# EAGLE design Z80HW (EAGLE 7.7.0)
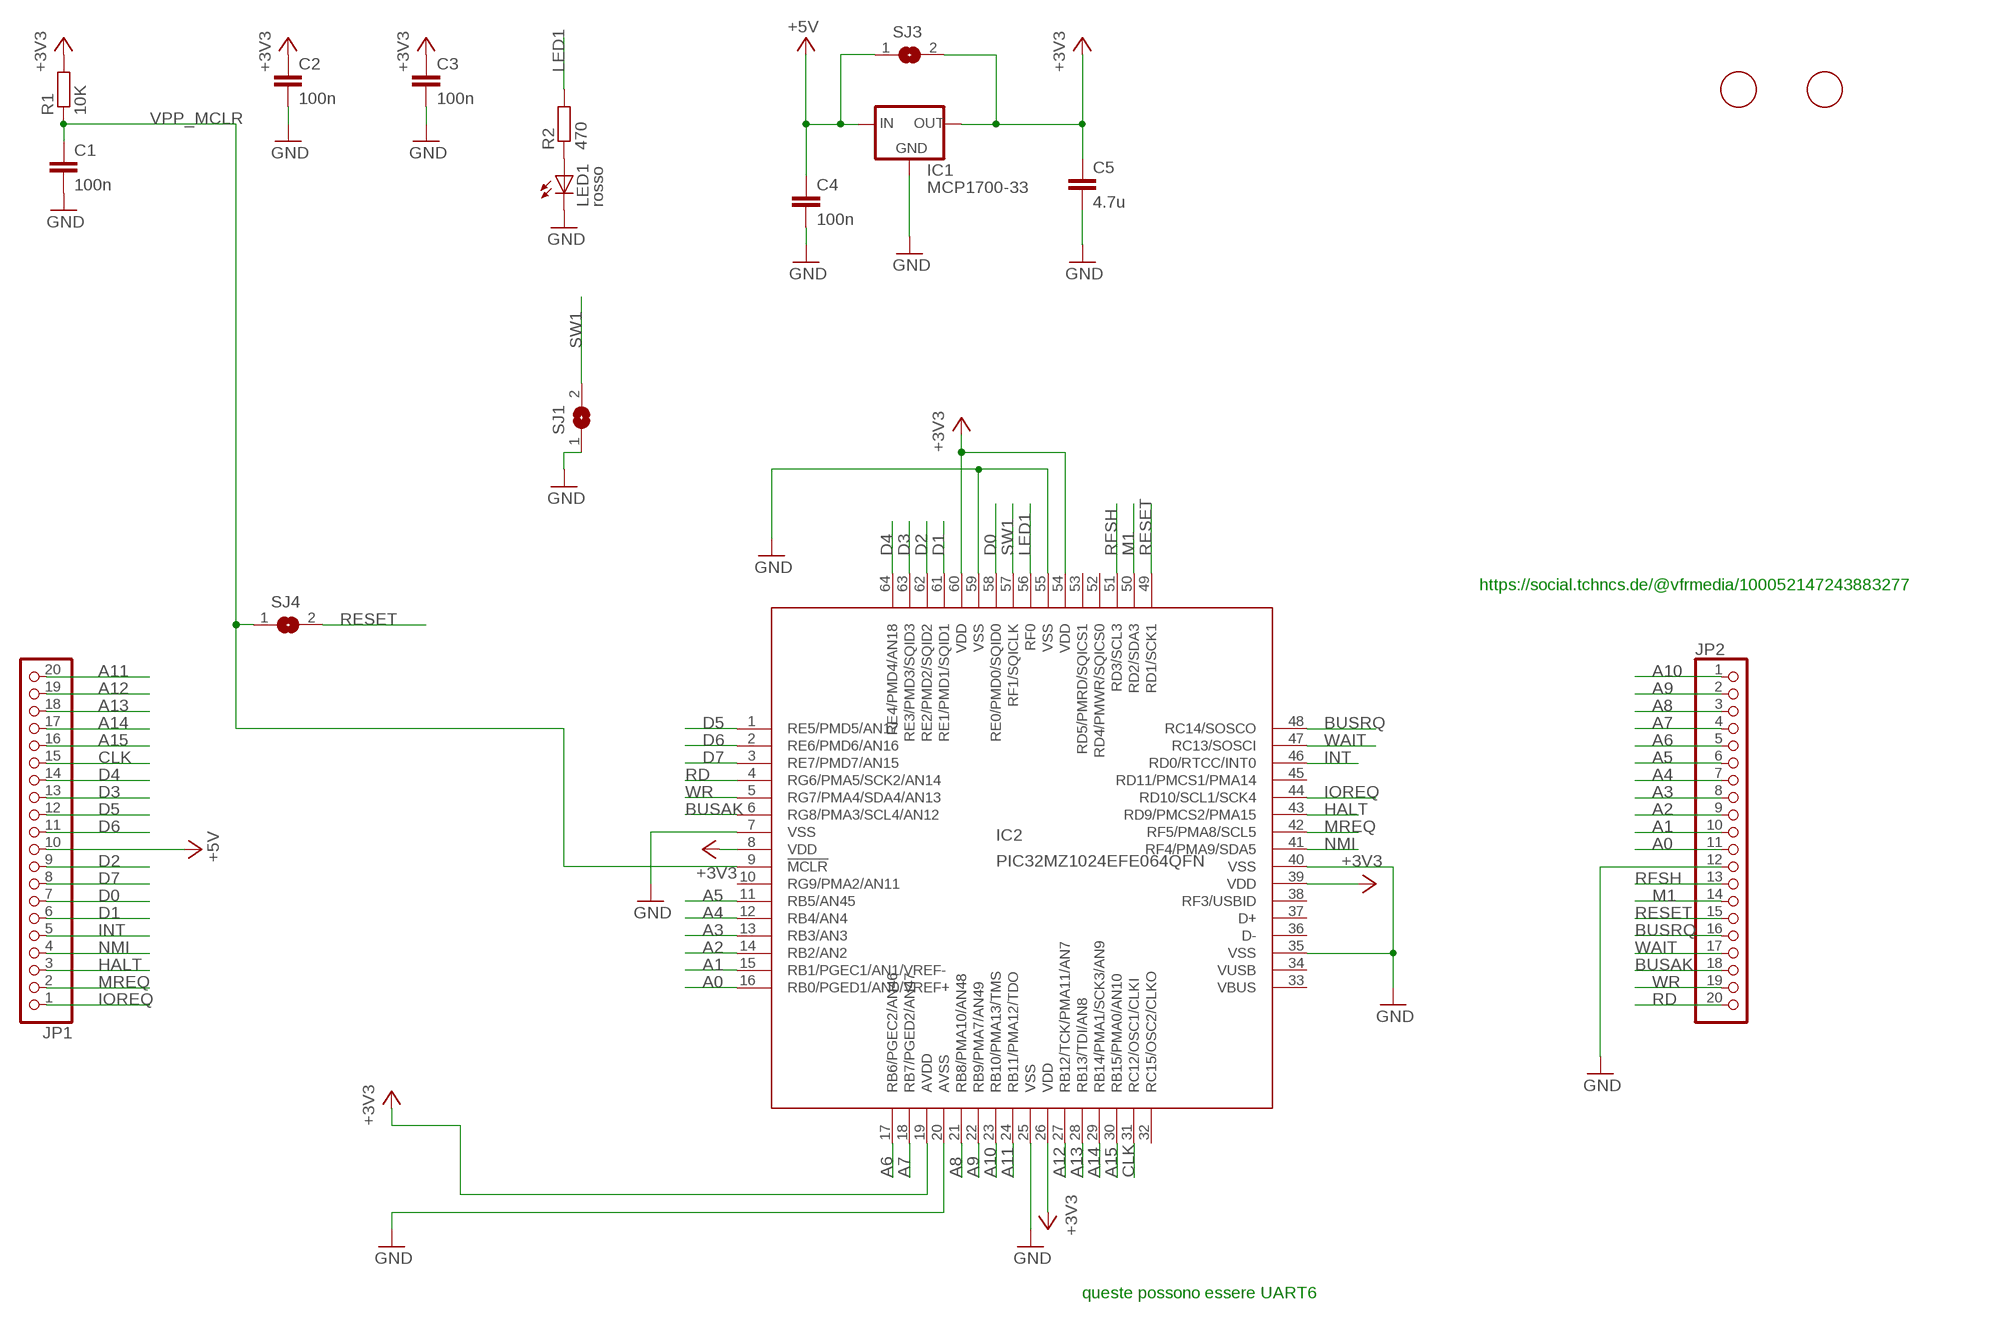
[diagram p0: schematic, sheet 1]

## Parts
C1  100n  C-EUC0805  [C0805]
C2  100n  C-EUC0805  [C0805]
C3  100n  C-EUC0805  [C0805]
C4  100n  C-EUC0805  [C0805]
C5  4.7u  C-EUC1206  [C1206]
F1  FIDUCIAL  [FIDUCIAL_1MM]
F2  FIDUCIAL  [FIDUCIAL_1MM]
IC1  MCP1700-33  MCP1700SOT23  [SOT23]
IC2  PIC32MZ1024EFE064QFN  [QFN64]
JP1  PINHD-1X20_2.54  [1X20]
JP2  PINHD-1X20_2.54  [1X20]
LED1  rosso  LEDCHIPLED_0805  [CHIPLED_0805]
R1  10K  R-EU_R0805  [R0805]
R2  470  R-EU_R0805  [R0805]
SJ1  SJ  [SJ]
SJ3  SJ  [SJ]
SJ4  SJ  [SJ]

## Nets
+3V3 [+3V3]: C2.1 C3.1 C5.1 IC1.2(OUT) IC2.8(VDD) IC2.19(AVDD) IC2.26(VDD) IC2.39(VDD) IC2.54(VDD) IC2.60(VDD) R1.2 SJ3.2
+5V [+5V]: C4.1 IC1.3(IN) JP1.10 SJ3.1
A0: IC2.16(RB0/PGED1/AN0/VREF+) JP2.11
A1: IC2.15(RB1/PGEC1/AN1/VREF-) JP2.10
A2: IC2.14(RB2/AN2) JP2.9
A3: IC2.13(RB3/AN3) JP2.8
A4: IC2.12(RB4/AN4) JP2.7
A5: IC2.11(RB5/AN45) JP2.6
A6: IC2.17(RB6/PGEC2/AN46) JP2.5
A7: IC2.18(RB7/PGED2/AN47) JP2.4
A8: IC2.21(RB8/PMA10/AN48) JP2.3
A9: IC2.22(RB9/PMA7/AN49) JP2.2
A10: IC2.23(RB10/PMA13/TMS) JP2.1
A11: IC2.24(RB11/PMA12/TDO) JP1.20
A12: IC2.27(RB12/TCK/PMA11/AN7) JP1.19
A13: IC2.28(RB13/TDI/AN8) JP1.18
A14: IC2.29(RB14/PMA1/SCK3/AN9) JP1.17
A15: IC2.30(RB15/PMA0/AN10) JP1.16
BUSAK: IC2.6(RG8/PMA3/SCL4/AN12) JP2.18
BUSRQ: IC2.48(RC14/SOSCO) JP2.16
CLK: IC2.31(RC12/OSC1/CLKI) JP1.15
D0: IC2.58(RE0/PMD0/SQID0) JP1.7
D1: IC2.61(RE1/PMD1/SQID1) JP1.6
D2: IC2.62(RE2/PMD2/SQID2) JP1.9
D3: IC2.63(RE3/PMD3/SQID3) JP1.13
D4: IC2.64(RE4/PMD4/AN18) JP1.14
D5: IC2.1(RE5/PMD5/AN17) JP1.12
D6: IC2.2(RE6/PMD6/AN16) JP1.11
D7: IC2.3(RE7/PMD7/AN15) JP1.8
GND [GND]: C1.2 C2.2 C3.2 C4.2 C5.2 IC1.1(GND) IC2.7(VSS) IC2.20(AVSS) IC2.25(VSS) IC2.35(VSS) IC2.40(VSS) IC2.55(VSS) IC2.59(VSS) JP2.12 LED1.C SJ1.1
HALT: IC2.43(RD9/PMCS2/PMA15) JP1.3
INT: IC2.46(RD0/RTCC/INT0) JP1.5
IOREQ: IC2.44(RD10/SCL1/SCK4) JP1.1
LED1: IC2.56(RF0) R2.2
M1: IC2.50(RD2/SDA3) JP2.14
MREQ: IC2.42(RF5/PMA8/SCL5) JP1.2
N$7: LED1.A R2.1
NMI: IC2.41(RF4/PMA9/SDA5) JP1.4
RD: IC2.4(RG6/PMA5/SCK2/AN14) JP2.20
RESET: IC2.49(RD1/SCK1) JP2.15 SJ4.2
RFSH: IC2.51(RD3/SCL3) JP2.13
SW1: IC2.57(RF1/SQICLK) SJ1.2
VPP_MCLR: C1.1 IC2.9(!MCLR) R1.1 SJ4.1
WAIT: IC2.47(RC13/SOSCI) JP2.17
WR: IC2.5(RG7/PMA4/SDA4/AN13) JP2.19
Unconnected: IC2.10(RG9/PMA2/AN11) IC2.32(RC15/OSC2/CLKO) IC2.33(VBUS) IC2.36(D-) IC2.37(D+) IC2.38(RF3/USBID) IC2.45(RD11/PMCS1/PMA14) IC2.52(RD4/PMWR/SQICS0) IC2.53(RD5/PMRD/SQICS1)

## Notes on the sheet
- https://social.tchncs.de/@vfrmedia/100052147243883277
- queste possono essere UART6

## Power pins joined to a net without a drawn wire
VUSB: IC2.34(VUSB)

## Library data of the parts
C1-C5 = resistor:C-EU: CAPACITOR, European symbol
F1 F2 = adafruit:FIDUCIAL: For use by pick and place machines to calibrate the vision/machine, 1mm By microbuilder.eu
IC1 = microchip2:MCP1700: VOLTAGE REGULATOR
IC2 = microchip2:PIC32MZ1024EFE064: PIC32MX340FxxxH Source: http://ww1.microchip.com/downloads/en/DeviceDoc/61143E.pdf, PIC32MZ1024EFE064.bsdl
JP1 JP2 = pinhead-2:PINHD-1X20: PIN HEADER
LED1 = led:LED: LED OSRAM: - CHIPLED LG R971, LG N971, LY N971, LG Q971, LY Q971, LO R971, LY R971 LH N974, LH R974 LS Q976, LO Q976, LY Q976 LO Q996 - Hyper CHIPLED LW Q18S LB Q993, LB Q99A, LB R99A - SideLED LS A670, LO A670, LY A670, LG A670, LP A670 LB A673, LV A673, LT A673, LW A673 LH A674 LY A675 LS A676, LA A676, LO A676, LY A676, LW A676 LS A679, LY A679, LG A679 - Hyper Micro SIDELED® LS Y876, LA Y876, LO Y876, LY Y876 LT Y87S - SmartLED LW L88C, LW L88S LB L89C, LB L89S, LG L890 LS L89K, LO L89K, LY L89K LS L896, LA L896, LO L896, LY L896 - TOPLED LS T670, LO T670, LY T670, LG T670, LP T670 LSG T670, LSP T670, LSY T670, LOP T670, LYG T670 LG T671, LOG T671, LSG T671 LB T673, LV T673, LT T673, LW T673 LH T674 LS T676, LA T676, LO T676, LY T676, LB T676, LH T676, LSB T676, LW T676 LB T67C, LV T67C, LT T67C, LS T67K, LO T67K, LY T67K, LW E67C LS E67B, LA E67B, LO E67B, LY E67B, LB E67C, LV E67C, LT E67C LW T67C LS T679, LY T679, LG T679 LS T770, LO T770, LY T770, LG T770, LP T770 LB T773, LV T773, LT T773, LW T773 LH T774 LS E675, LA E675, LY E675, LS T675 LS T776, LA T776, LO T776, LY T776, LB T776 LHGB T686 LT T68C, LB T68C - Hyper Mini TOPLED® LB M676 - Mini TOPLED Santana® LG M470 LS M47K, LO M47K, LY M47K Source: http://www.osram.convergy.de LUXEON: - LUMILED® LXK2-PW12-R00, LXK2-PW12-S00, LXK2-PW14-U00, LXK2-PW14-V00 LXK2-PM12-R00, LXK2-PM12-S00, LXK2-PM14-U00 LXK2-PE12-Q00, LXK2-PE12-R00, LXK2-PE12-S00, LXK2-PE14-T00, LXK2-PE14-U00 LXK2-PB12-K00, LXK2-PB12-L00, LXK2-PB12-M00, LXK2-PB14-N00, LXK2-PB14-P00, LXK2-PB14-Q00 LXK2-PR12-L00, LXK2-PR12-M00, LXK2-PR14-Q00, LXK2-PR14-R00 LXK2-PD12-Q00, LXK2-PD12-R00, LXK2-PD12-S00 LXK2-PH12-R00, LXK2-PH12-S00 LXK2-PL12-P00, LXK2-PL12-Q00, LXK2-PL12-R00 Source: www.luxeon.com KINGBRIGHT: KA-3528ASYC Source: www.kingbright.com
R1 R2 = resistor:R-EU_: RESISTOR, European symbol
SJ1 SJ3 SJ4 = jumper:SJ: SMD solder JUMPER

## Net classes
1 VCC: width 0.305 mm, clearance 0.152 mm
2 N2: width 0.762 mm, clearance 0.762 mm
3 N3: width 0.508 mm
4 N4: width 0.305 mm
5 +5V: width 0.305 mm, clearance 0.152 mm
6 +3V3: width 0.305 mm, clearance 0.152 mm
7 GND: width 0.305 mm, clearance 0.152 mm

## Board
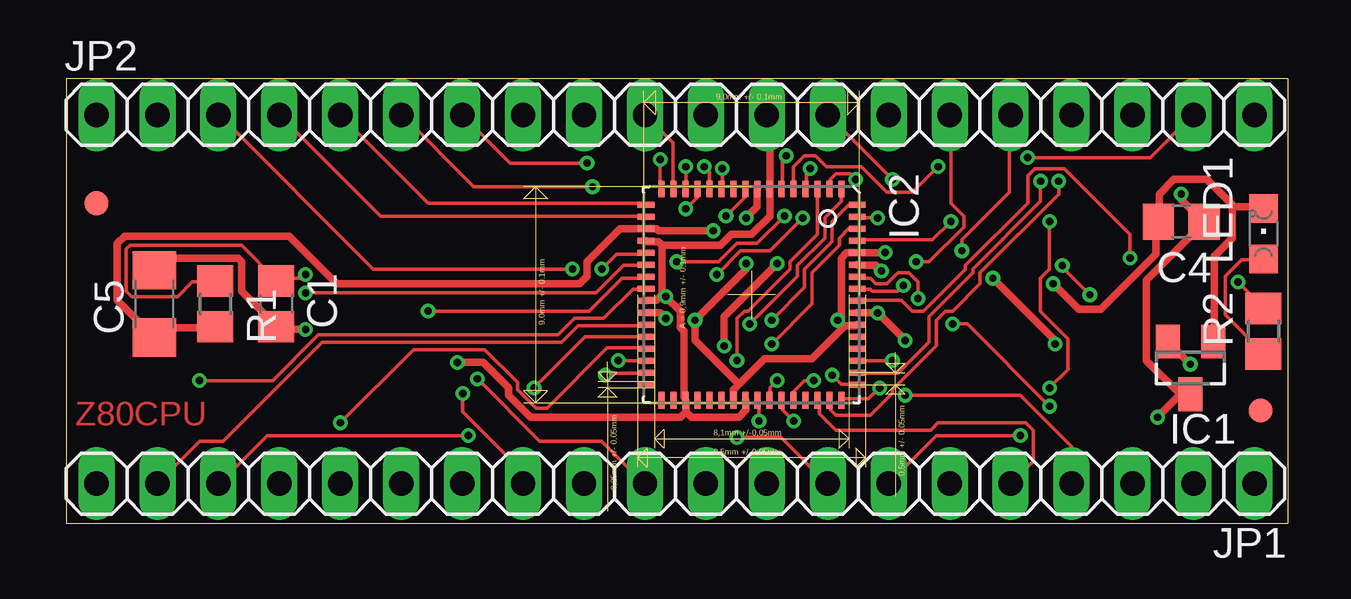
[diagram p1: board, top side]
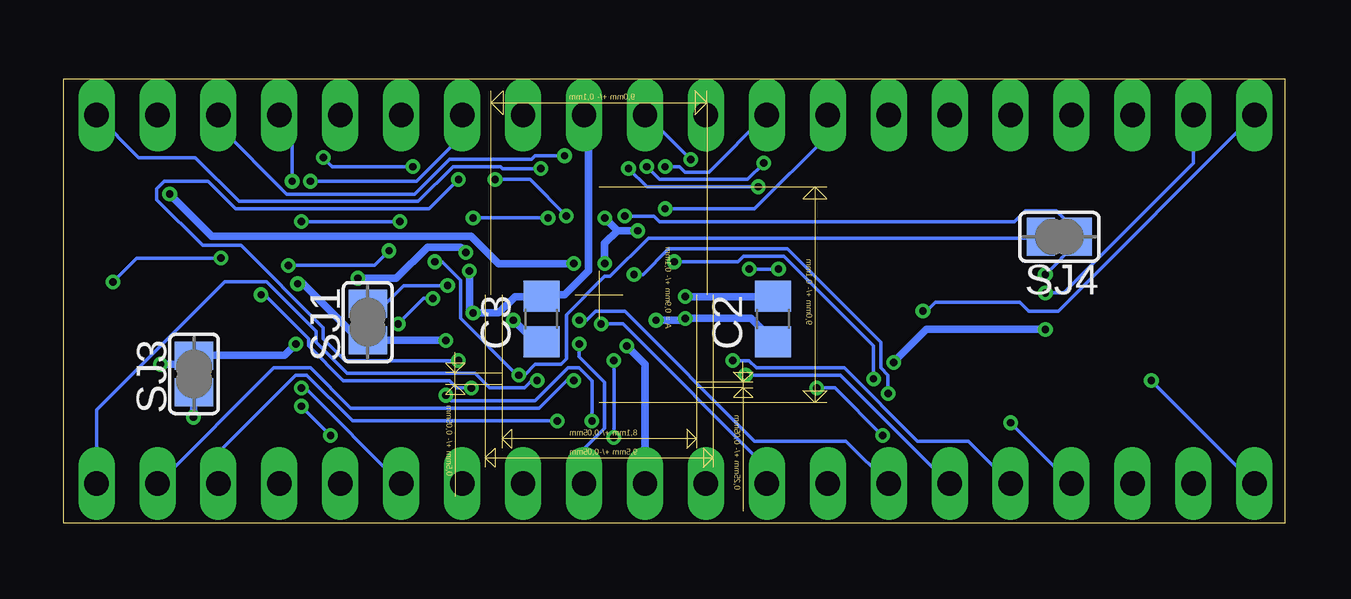
[diagram p2: board, bottom side, seen from below]

Size 50.93 x 18.53 mm. Coordinates in mm from the lower left corner, seen from the top.
Outline: 0,0 50.93,0 50.93,18.53 0,18.53 0,0
Copper layers (1*16): Top 0.035mm / dielectric 1.5mm / Bottom 0.035mm
Design rules "SeeedStudio_2layer_DRU_no_angle_20140221": minimum track width 6mil, minimum drill 12mil, track to track 6mil, track to pad 6mil, pad to pad 6mil, via to via 6mil, smd to smd 0mil, copper to edge 10mil, drill to drill 10mil, minimum pad ring 10mil, minimum via ring 6mil, stop-mask expansion 2mil, vias tented up to drill 100mil, thermal gap 10mil

### Footprints (pad centres in the part's own frame; a part is rotated, then mirrored left to right if it is on the bottom)
C0805 = smd 1.3 x 1.5: 1 -0.95,0; 2 0.95,0
C1206 = smd 1.6 x 1.8: 1 -1.4,0; 2 1.4,0
FIDUCIAL_1MM = smd 1 x 1: 1 0,0
SOT23 = smd 1 x 1.4: 1 -0.95,-1.1; 2 0.95,-1.1; 3 0,1.1
QFN64 = smd 0.7 x 0.25: 1 -4.4,3.75; 2 -4.4,3.25; 3 -4.4,2.75; 4 -4.4,2.25; 5 -4.4,1.75; 6 -4.4,1.25; 7 -4.4,0.75; 8 -4.4,0.25; 9 -4.4,-0.25; 10 -4.4,-0.75; 11 -4.4,-1.25; 12 -4.4,-1.75; 13 -4.4,-2.25; 14 -4.4,-2.75; 15 -4.4,-3.25; 16 -4.4,-3.75; 33 4.4,-3.75; 34 4.4,-3.25; 35 4.4,-2.75; 36 4.4,-2.25; 37 4.4,-1.75; 38 4.4,-1.25; 39 4.4,-0.75; 40 4.4,-0.25; 41 4.4,0.25; 42 4.4,0.75; 43 4.4,1.25; 44 4.4,1.75; 45 4.4,2.25; 46 4.4,2.75; 47 4.4,3.25; 48 4.4,3.75 | smd 0.25 x 0.7: 17 -3.75,-4.4; 18 -3.25,-4.4; 19 -2.75,-4.4; 20 -2.25,-4.4; 21 -1.75,-4.4; 22 -1.25,-4.4; 23 -0.75,-4.4; 24 -0.25,-4.4; 25 0.25,-4.4; 26 0.75,-4.4; 27 1.25,-4.4; 28 1.75,-4.4; 29 2.25,-4.4; 30 2.75,-4.4; 31 3.25,-4.4; 32 3.75,-4.4; 49 3.75,4.4; 50 3.25,4.4; 51 2.75,4.4; 52 2.25,4.4; 53 1.75,4.4; 54 1.25,4.4; 55 0.75,4.4; 56 0.25,4.4; 57 -0.25,4.4; 58 -0.75,4.4; 59 -1.25,4.4; 60 -1.75,4.4; 61 -2.25,4.4; 62 -2.75,4.4; 63 -3.25,4.4; 64 -3.75,4.4
1X20 = drill 1.016 long: 1 -24.13,0; 2 -21.59,0; 3 -19.05,0; 4 -16.51,0; 5 -13.97,0; 6 -11.43,0; 7 -8.89,0; 8 -6.35,0; 9 -3.81,0; 10 -1.27,0; 11 1.27,0; 12 3.81,0; 13 6.35,0; 14 8.89,0; 15 11.43,0; 16 13.97,0; 17 16.51,0; 18 19.05,0; 19 21.59,0; 20 24.13,0
CHIPLED_0805 = smd 1.2 x 1.2: A 0,-1.05; C 0,1.05
R0805 = smd 1.3 x 1.5: 1 -0.95,0; 2 0.95,0
SJ = smd 1.168 x 1.6: 1 -0.762,0; 2 0.762,0

### Placement (x,y rotation side)
C1  8.76,9.14 270 top
C2  21.34,8.51 90 bottom
C3  30.99,8.51 90 bottom
C4  46.48,12.57 180 top
C5  3.68,9.14 90 top
F1  1.27,13.34 0 top
F2  49.78,4.7 0 top
IC1  46.86,6.48 180 top
IC2  28.57,9.53 270 top
JP1  25.4,1.65 180 top
JP2  25.4,17.02 0 top
LED1  49.91,12.06 0 top
R1  6.22,9.14 270 top
R2  49.91,8 90 top
SJ1  38.23,8.38 90 bottom
SJ3  45.47,6.22 90 bottom
SJ4  9.4,11.94 180 bottom

### Tracks (layer width: path | path; a pad name or v marks a point on that pad's centre or on a via)
+3V3  (via drill 0.3)
  Top 0.305: v24.99,8.53 24.77,8.76 24.23,8.76 IC2.26 | v46.86,6.63 45.95,7.54 IC1.2 | 28.04,5.79 29.11,6.86 31.09,6.86 32.38,8.15 | 28.04,5.79 27.81,5.56 27.81,5.18 IC2.39 | 32.38,8.15 32.46,8.23 32.92,8.23 IC2.54 | 32.31,8.46 32.31,8.23 32.38,8.15 | 32.31,8.46 32.31,11.05 32.54,11.28 32.92,11.28 IC2.60 33.07,11.28 v34.14,11.28 | v32.16,8.46 32.31,8.46 | v41.22,7.47 41.22,7.62 v38.63,10.21 | 28.04,5.79 26.21,7.62 v26.21,8.46 28.35,10.59 v28.35,10.82 | v28.35,12.72 28.8,13.18 28.8,13.87 IC2.8 | v26.98,12.19 24.69,12.19 24.61,12.27 24.31,12.27 IC2.19 24.16,12.27 23.09,12.27 21.72,10.9 21.72,10.29 21.41,9.98 11.28,9.98 9.3,11.96 2.44,11.96 2.13,11.66 2.13,9.3 3.66,7.77 C5.1 3.81,7.77 4.19,8.15 6.17,8.15 R1.2
  Bottom 0.305: C2.1 21.34,7.62 22.25,8.53 v24.99,8.53 25.07,8.46 v26.21,8.46 | v46.86,6.63 45.8,6.63 45.49,6.93 SJ3.2 45.34,7.01 41.68,7.01 v41.22,7.47 | v32.16,8.46 31.32,7.62 31.01,7.62 C3.1 | v38.63,10.21 37.03,10.21 35.74,11.51 34.37,11.51 v34.14,11.28 | 27.81,12.19 v28.35,12.72 | v26.98,12.19 27.81,12.19 | v28.35,10.82 28.35,11.66 27.81,12.19
+5V  (via drill 0.3)
  Top 0.305: v45.49,4.42 46.41,5.33 IC1.3 46.86,5.41 46.41,5.41 45.03,6.78 45.03,10.13 47.47,12.57 C4.1 47.32,12.65 46.48,13.49 v46.48,13.72 | v27.43,7.39 27.43,8.61 v29.64,10.82
  Bottom 0.305: v45.49,4.42 45.49,5.41 SJ3.1 | JP1.10 26.67,6.63 v27.43,7.39 | v29.64,10.82 32.77,10.82 33.91,11.96 44.73,11.96 v46.48,13.72
A0  (via drill 0.3)
  Top 0.152: v24.77,15.16 24.77,13.95 IC2.16
  Bottom 0.152: v24.77,15.16 26.67,17.07 JP2.11
A1
  Top 0.152: JP2.10 25.3,15.85 25.3,13.95 IC2.15
A2  (via drill 0.3)
  Top 0.152: v25.83,14.86 25.83,13.95 IC2.14
  Bottom 0.152: v25.83,14.86 25.22,14.86 24.99,14.63 24,14.63 21.64,16.99 JP2.9
A3  (via drill 0.3)
  Top 0.152: v25.83,13.11 26.29,13.56 26.29,13.87 IC2.13
  Bottom 0.152: v25.83,13.11 22.1,13.11 19.05,16.15 JP2.8
A4  (via drill 0.3)
  Top 0.152: v26.59,14.86 26.82,14.63 26.82,13.95 IC2.12 | v21.72,15.01 18.52,15.01 JP2.7
  Bottom 0.152: v26.59,14.86 26.06,14.33 22.4,14.33 v21.72,15.01
A5  (via drill 0.3)
  Top 0.152: v27.36,14.78 27.36,13.95 IC2.11 | v21.95,14.02 16.99,14.02 14.02,16.99 JP2.6
  Bottom 0.152: v27.36,14.78 26.59,14.02 v21.95,14.02
A6
  Top 0.152: IC2.17 24.16,13.34 15.09,13.34 11.43,16.99 JP2.5
A7
  Top 0.152: JP2.4 13.11,12.8 24.16,12.8 IC2.18
A8  (via drill 0.3)
  Top 0.152: v22.33,10.59 22.94,11.2 24.16,11.2 IC2.21 | v21.11,10.59 12.8,10.59 6.4,16.99 JP2.3
  Bottom 0.152: v21.11,10.59 v22.33,10.59
A9  (via drill 0.3)
  Top 0.152: v9.98,9.6 22.1,9.6 23.24,10.74 24.16,10.74 IC2.22
  Bottom 0.152: v9.98,9.6 9.22,9.6 3.81,15.01 JP2.2
A10  (via drill 0.3)
  Top 0.152: v15.09,8.84 21.79,8.84 23.16,10.21 24.16,10.21 IC2.23
  Bottom 0.152: v15.09,8.84 14.94,8.84 14.55,9.22 11.05,9.22 10.67,8.84 9.45,8.84 JP2.1
A11  (via drill 0.3)
  Top 0.152: v5.56,5.94 8.61,5.94 10.52,7.85 20.5,7.85 21.18,8.53 22.4,8.53 23.62,9.75 24.16,9.75 IC2.24
  Bottom 0.152: JP1.20 v5.56,5.94
A12
  Top 0.152: IC2.27 24.16,8.23 21.34,8.23 20.65,7.54 10.67,7.54 6.55,3.43 5.56,3.43 3.81,1.68 JP1.19
A13  (via drill 0.3)
  Top 0.152: v19.51,5.64 21.64,7.77 24.16,7.77 IC2.28 | v16.76,3.66 8.38,3.66 6.4,1.68 JP1.18
  Bottom 0.152: v19.51,5.64 18.75,5.64 v16.76,3.66
A14  (via drill 0.3)
  Top 0.152: v11.43,4.19 14.48,7.24 17.45,7.24 18.82,5.87 18.82,5.56 19.58,4.8 20.04,4.8 22.55,7.32 24.16,7.32 IC2.29
  Bottom 0.152: JP1.17 v11.43,4.19
A15  (via drill 0.3)
  Top 0.152: v23.01,6.78 24.16,6.78 IC2.30
  Bottom 0.152: v23.01,6.78 22.33,6.78 22.02,6.48 18.36,6.48 15.32,3.43 13.18,3.43 11.43,1.68 JP1.16
BUSAK  (via drill 0.3)
  Top 0.152: v30.02,15.32 29.87,15.16 29.87,13.95 IC2.6
  Bottom 0.152: v30.02,15.32 31.24,15.32 31.39,15.16 34.82,15.16 36.27,13.72 41.6,13.72 44.42,16.54 44.42,16.99 JP2.18
BUSRQ  (via drill 0.3)
  Top 0.152: v33.91,5.64 33.45,5.18 32.38,5.18 IC2.48 | v42.67,9.53 41.53,10.67 v41.53,10.74 | v37.34,11.35 37.34,11.81 39.32,13.79 39.32,16.99 JP2.16
  Bottom 0.152: v33.91,5.64 34.52,5.64 34.82,5.94 39.24,5.94 40.69,7.39 40.69,7.7 42.52,9.53 v42.67,9.53 | v41.53,10.74 37.95,10.74 v37.34,11.35
CLK  (via drill 0.3)
  Top 0.152: v22.48,6.17 22.55,6.25 24.16,6.25 IC2.31
  Bottom 0.152: v22.48,6.17 18.52,6.17 14.02,1.68 JP1.15
D0  (via drill 0.3)
  Top 0.152: v35.51,9.37 35.51,10.06 35.13,10.44 34.67,10.44 34.21,9.98 33.76,9.98 33.53,10.21 32.99,10.21 IC2.58 | v36.96,8.31 37.57,8.31 v41,4.88 | v39.78,3.66 36.27,3.66 34.29,1.68 JP1.7
  Bottom 0.152: v35.51,9.37 35.89,9.37 v36.96,8.31 | v39.78,3.66 v41,4.88
D1  (via drill 0.3)
  Top 0.152: v36.88,12.57 36.12,11.81 32.99,11.81 IC2.61 | v41,12.57 41,10.59 40.62,10.21 40.62,8.84 41.76,7.7 41.76,6.4 v41,5.64
  Bottom 0.152: v41,12.57 v36.88,12.57 | v41,5.64 40.84,5.64 36.88,1.68 JP1.6
D2  (via drill 0.3)
  Top 0.152: v29.41,7.47 31.09,9.14 31.09,10.44 32.23,11.58 32.23,11.89 32.61,12.27 32.92,12.27 IC2.62
  Bottom 0.152: v29.41,7.47 29.41,6.93 28.35,5.87 28.35,3.96 29.18,3.12 29.18,1.68 JP1.9
D3  (via drill 0.3)
  Top 0.152: v33.83,12.72 32.99,12.72 IC2.63 | v30.71,12.72 29.34,11.35 28.12,11.35 v27.13,10.36 | v16.54,5.41 16.54,4.65 19.05,2.13 JP1.13
  Bottom 0.152: v30.71,12.72 v33.83,12.72 | v27.13,10.36 26.75,10.36 25.68,11.43 20.73,11.43 16.84,7.54 16.84,6.48 16.54,6.17 v16.54,5.41
D4  (via drill 0.3)
  Top 0.152: v29.41,8.46 30.79,9.83 30.79,10.59 31.93,11.73 31.93,12.57 32.61,13.26 32.92,13.26 IC2.64
  Bottom 0.152: v29.41,8.46 29.11,8.46 28.73,8.84 27.51,8.84 22.1,3.43 18.29,3.43 JP1.14
D5  (via drill 0.3)
  Top 0.152: v28.5,8.31 30.48,10.29 30.48,10.74 31.62,11.89 31.62,12.72 32.31,13.41 32.31,13.87 IC2.1
  Bottom 0.152: v28.5,8.31 27.58,8.31 21.64,2.36 21.64,1.68 JP1.12
D6  (via drill 0.3)
  Top 0.152: v32.92,14.33 32.69,14.55 32.08,14.55 31.85,14.33 31.85,13.95 IC2.2 | v29.95,12.8 28.8,11.66 27.96,11.66 27.2,10.9 v25.45,10.9 | v17.14,6.02 19.74,3.43 22.33,3.43 24.08,1.68 JP1.11
  Bottom 0.152: v32.92,14.33 31.47,14.33 v29.95,12.8 | v25.45,10.9 22.78,10.9 22.55,11.12 20.88,11.12 17.14,7.39 v17.14,6.02
D7  (via drill 0.3)
  Top 0.152: v27.96,6.78 27.96,8.53 28.27,8.84 28.42,8.84 30.18,10.59 30.18,10.9 31.32,12.04 31.32,13.87 IC2.3 | v27.96,3.58 29.79,3.58 31.7,1.68 JP1.8
  Bottom 0.152: v27.96,3.58 v27.96,6.78
GND  (via drill 0.3)
  Top 0.305: 48.69,13.18 49.91,13.18 LED1.C | 48.69,13.18 47.55,14.33 46.18,14.33 45.57,13.72 45.57,12.57 C4.2 45.41,12.5 45.41,11.2 43.13,8.91 42.22,8.91 v41.15,9.98 | IC1.1 47.85,7.62 47.85,11.12 48.62,11.89 48.62,13.11 48.69,13.18 | IC2.55 32.99,8.76 v33.83,8.76 v34.98,7.62 | v33.98,10.52 33.76,10.74 32.99,10.74 IC2.59 | C5.2 3.73,10.59 4.19,11.05 7.16,11.05 7.32,10.9 7.32,9.68 8.76,8.23 C1.2 8.84,8.08 v9.98,8.08 | JP2.12 29.26,16.99 29.34,16.92 29.34,13.95 IC2.7 29.34,13.79 29.34,12.8 28.57,12.04 27.74,12.04 27.28,11.58 24.84,11.58 | 25.83,4.65 25.83,5.11 IC2.35 25.76,5.26 25.76,8 25.6,8.15 25.6,8.84 v24.99,9.45 24.92,9.45 24.84,9.53 | 25.83,4.65 26.06,4.42 28.04,4.42 28.35,4.72 28.35,5.11 IC2.40 | 24.84,9.53 24.61,9.3 24.23,9.3 IC2.25 | 24.84,11.58 24.84,9.53 | 24.84,11.58 24.69,11.73 24.23,11.73 IC2.20 | v16.31,6.71 17.37,6.71 18.44,5.64 18.44,5.33 19.36,4.42 25.6,4.42 25.83,4.65
  Bottom 0.305: v33.98,10.52 33.98,8.91 v33.83,8.76 32.77,8.76 32.08,9.45 31.01,9.45 C3.2 30.86,9.53 30.02,9.53 29.03,10.52 29.03,16.84 JP2.12 | v34.98,7.62 SJ1.1 38.33,7.7 38.63,7.7 40.92,9.98 v41.15,9.98 | v24.99,9.45 C2.2 | v9.98,8.08 14.94,8.08 v16.31,6.71
HALT  (via drill 0.3)
  Top 0.152: v30.33,4.27 29.87,4.72 29.87,5.11 IC2.43
  Bottom 0.152: v30.33,4.27 38.86,4.27 40.77,6.17 41.22,6.17 44.42,2.97 44.42,1.68 JP1.3
INT
  Top 0.152: JP1.5 40.31,2.59 40.31,3.89 40.01,4.19 36.35,4.19 36.04,3.89 32.08,3.89 31.39,4.57 31.39,5.11 IC2.46
IOREQ  (via drill 0.3)
  Top 0.152: v31.17,5.94 30.79,5.94 30.33,5.49 30.33,5.18 IC2.44
  Bottom 0.152: v31.17,5.94 31.39,5.94 31.7,5.64 33.15,5.64 33.76,6.25 39.09,6.25 40.39,7.54 40.39,8 42.44,10.06 44.2,10.06 49.53,4.72 JP1.1
LED1  (via drill 0.3)
  Top 0.152: v44.35,11.05 44.35,12.04 41.6,14.78 40.39,14.78 40.08,14.48 40.08,13.34 37.49,10.74 37.49,10.59 35.74,8.84 35.28,8.84 34.82,9.3 32.99,9.3 IC2.56 | v48.84,10.06 49.91,8.99 R2.2
  Bottom 0.152: v44.35,11.05 47.85,11.05 v48.84,10.06
M1  (via drill 0.3)
  Top 0.152: v40.62,14.25 40.62,13.41 37.8,10.59 37.8,10.44 35.97,8.61 35.97,7.54 34.67,6.25 32.99,6.25 IC2.50
  Bottom 0.152: v40.62,14.25 36.2,14.25 34.29,16.15 JP2.14
MREQ  (via drill 0.3)
  Top 0.152: v29.64,5.94 29.34,5.64 29.34,5.18 IC2.42
  Bottom 0.152: v29.64,5.94 29.95,5.94 31.09,4.8 38.94,4.8 40.62,6.48 42.14,6.48 46.94,1.68 JP1.2
N$7
  Top 0.152: LED1.A 49.91,10.97 49,10.97 48.31,10.29 48.31,8.69 49.91,7.09 R2.1
NMI  (via drill 0.3)
  Top 0.152: v28.88,4.27 28.88,5.11 IC2.41 | v34.98,5.33 39.78,5.33 41.91,3.2 JP1.4
  Bottom 0.152: v28.88,4.27 28.88,5.94 29.41,6.48 29.87,6.48 31.24,5.11 34.75,5.11 v34.98,5.33
RD  (via drill 0.3)
  Top 0.152: v31.01,14.78 30.86,14.63 30.86,13.95 IC2.4
  Bottom 0.152: v31.01,14.78 32.61,14.78 32.69,14.86 34.67,14.86 36.12,13.41 43.59,13.41 45.41,15.24 47.78,15.24 49.53,16.99 JP2.20
RESET  (via drill 0.3)
  Top 0.152: v31.93,6.17 32.31,5.79 32.92,5.79 IC2.49 | v35.43,10.9 35.97,10.9 37.41,12.34 37.41,12.8 36.88,13.34 36.88,16.99 JP2.15
  Bottom 0.152: SJ4.2 10.21,11.89 26.52,11.89 28.12,10.29 28.35,10.29 29.95,8.69 29.95,6.86 30.18,6.63 31.24,6.63 31.7,6.17 v31.93,6.17 32,6.17 34.37,8.53 34.37,10.13 35.13,10.9 v35.43,10.9
RFSH  (via drill 0.3)
  Top 0.152: v34.44,6.78 32.99,6.78 IC2.51 | JP2.13 v34.44,14.33
  Bottom 0.152: v34.44,6.78 39.17,6.78 40.08,7.7 40.08,8.15 43.51,11.58 45.11,11.58 47.02,13.49 47.02,13.95 46.71,14.25 44.88,14.25 43.74,13.11 35.66,13.11 v34.44,14.33
SW1  (via drill 0.3)
  Top 0.152: v34.9,9.91 34.67,9.68 33.6,9.68 33.53,9.75 32.99,9.75 IC2.57
  Bottom 0.152: v34.9,9.91 36.73,9.91 37.49,9.14 SJ1.2
VPP_MCLR  (via drill 0.3)
  Top 0.152: R1.1 6.17,10.06 5.26,10.06 4.65,9.45 2.74,9.45 2.52,9.68 2.52,11.43 2.67,11.58 7.32,11.58 8.76,10.13 C1.1 8.76,10.21 9.83,10.21 v9.98,10.36 | v27.51,12.8 28.27,13.56 28.27,13.87 IC2.9
  Bottom 0.152: v27.51,12.8 26.29,12.8 26.06,12.57 11.28,12.57 10.82,13.03 9.53,13.03 8.69,12.19 8.69,11.96 SJ4.1 8.69,11.89 8.69,11.66 v9.98,10.36
WAIT  (via drill 0.3)
  Top 0.152: v41.38,14.25 41.38,13.72 38.1,10.44 38.1,9.98 36.96,8.84 36.65,8.84 36.27,8.46 36.27,7.39 34.44,5.56 34.44,5.41 33.53,4.5 32.08,4.5 31.85,4.72 31.85,5.11 IC2.47
  Bottom 0.152: v41.38,14.25 41.38,16.46 41.91,16.99 JP2.17
WR  (via drill 0.3)
  Top 0.152: v36.35,14.86 35.28,13.79 34.21,13.79 33.15,14.86 31.7,14.86 31.24,15.32 30.79,15.32 30.33,14.86 30.33,13.95 IC2.5 | v40.08,15.24 45.19,15.24 46.94,16.99 JP2.19
  Bottom 0.152: v36.35,14.86 39.7,14.86 v40.08,15.24

### Text on the board
Top: Z80CPU